# EAGLE design motor-control-board (EAGLE 7.2.0)
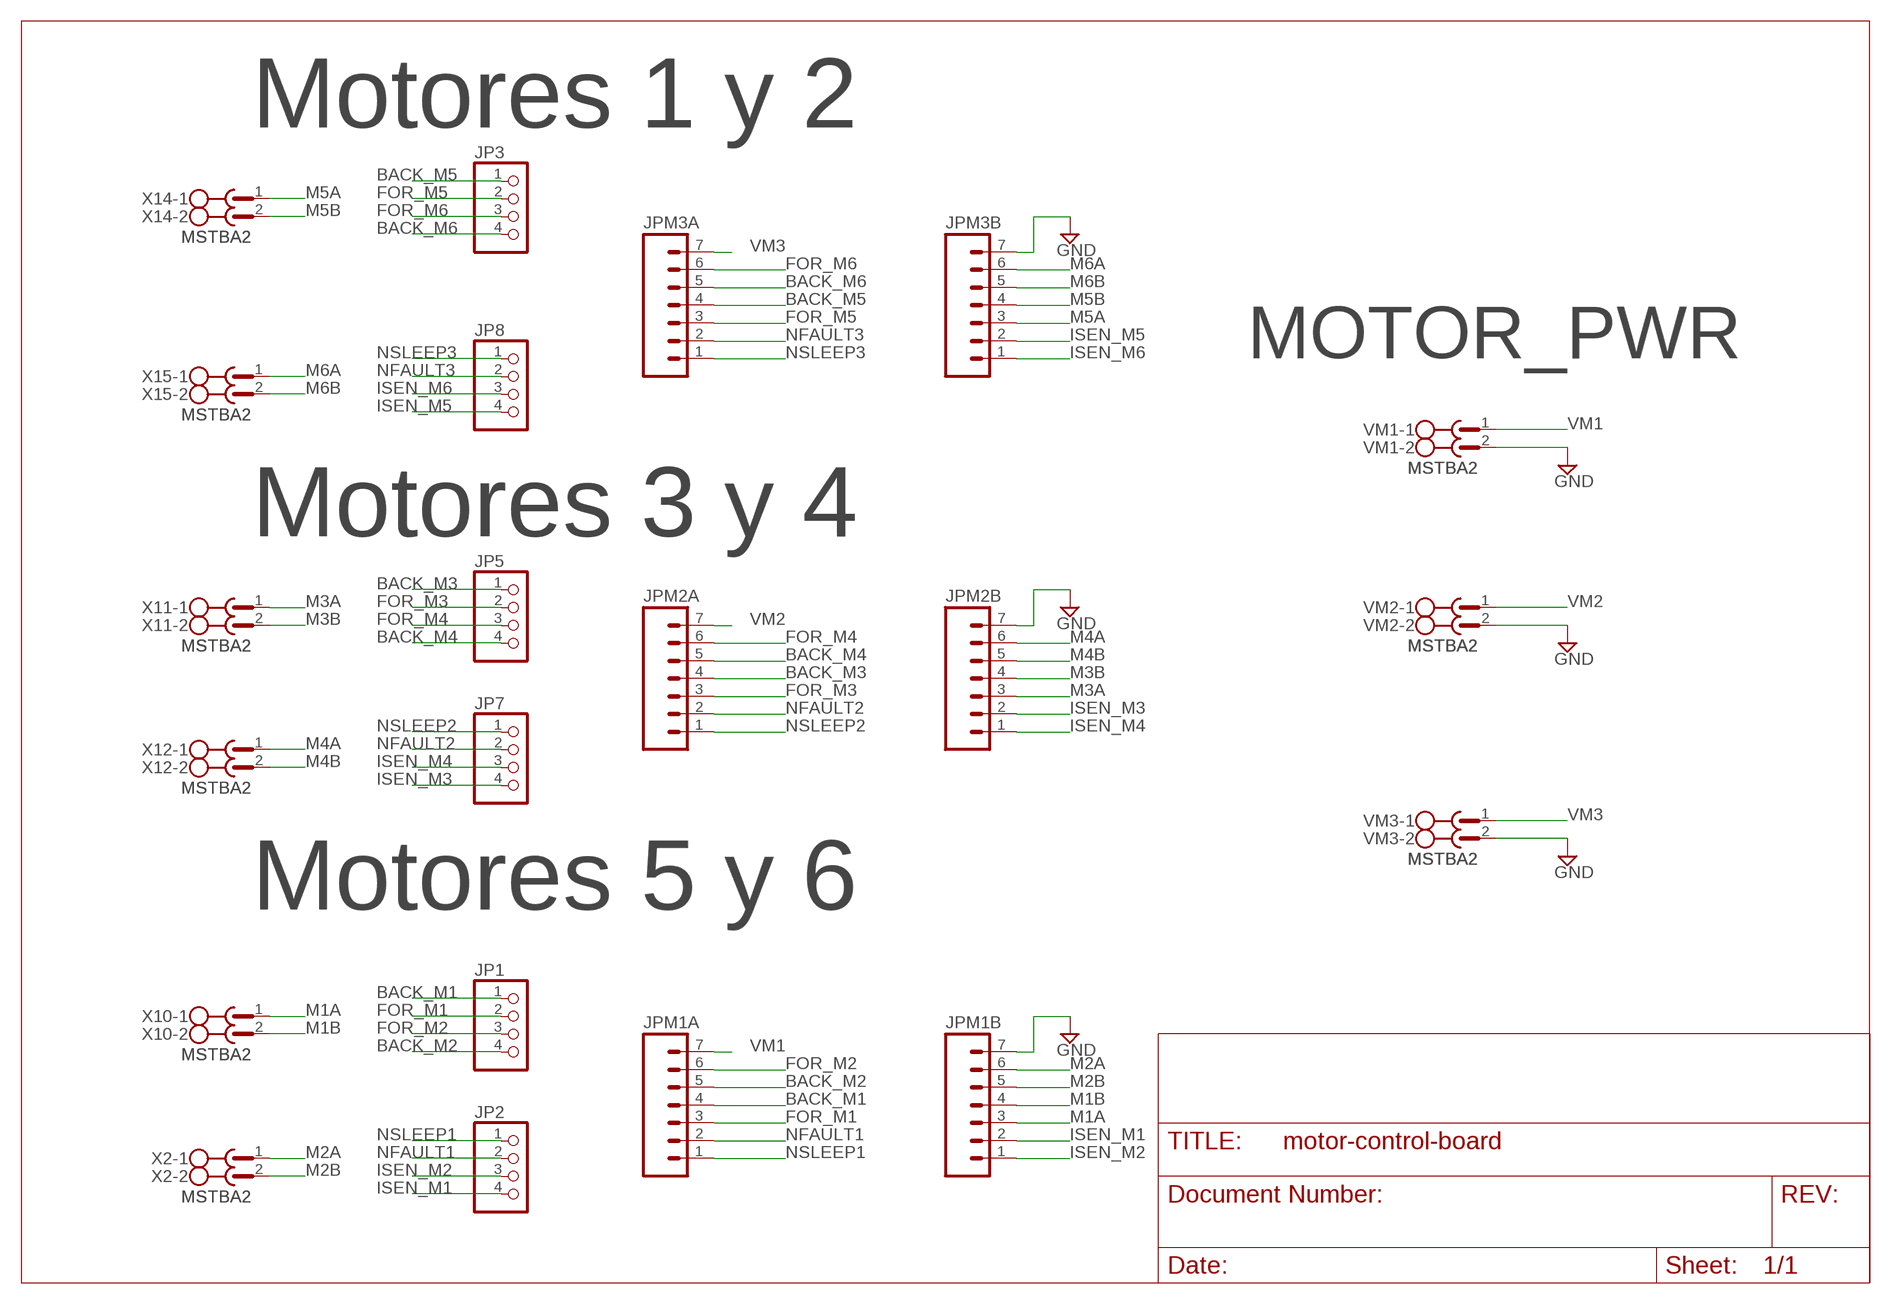
[diagram p0: schematic, sheet 1]

## Parts
JP1  PINHD-1X4  [1X04]
JP2  PINHD-1X4  [1X04]
JP3  PINHD-1X4  [1X04]
JP5  PINHD-1X4  [1X04]
JP7  PINHD-1X4  [1X04]
JP8  PINHD-1X4  [1X04]
JPM1A  M07  [1X07]
JPM1B  M07  [1X07]
JPM2A  M07  [1X07]
JPM2B  M07  [1X07]
JPM3A  M07  [1X07]
JPM3B  M07  [1X07]
VM1  MSTBA2  [MSTBA2]
VM2  MSTBA2  [MSTBA2]
VM3  MSTBA2  [MSTBA2]
X2  MSTBA2  [MSTBA2]
X10  MSTBA2  [MSTBA2]
X11  MSTBA2  [MSTBA2]
X12  MSTBA2  [MSTBA2]
X14  MSTBA2  [MSTBA2]
X15  MSTBA2  [MSTBA2]

## Nets
BACK_M1: JP1.1 JPM1A.4
BACK_M2: JP1.4 JPM1A.5
BACK_M3: JP5.1 JPM2A.4
BACK_M4: JP5.4 JPM2A.5
BACK_M5: JP3.1 JPM3A.4
BACK_M6: JP3.4 JPM3A.5
FOR_M1: JP1.2 JPM1A.3
FOR_M2: JP1.3 JPM1A.6
FOR_M3: JP5.2 JPM2A.3
FOR_M4: JP5.3 JPM2A.6
FOR_M5: JP3.2 JPM3A.3
FOR_M6: JP3.3 JPM3A.6
GND: JPM1B.7 JPM2B.7 JPM3B.7 VM1.2 VM2.2 VM3.2
ISEN_M1: JP2.4 JPM1B.2
ISEN_M2: JP2.3 JPM1B.1
ISEN_M3: JP7.4 JPM2B.2
ISEN_M4: JP7.3 JPM2B.1
ISEN_M5: JP8.4 JPM3B.2
ISEN_M6: JP8.3 JPM3B.1
M1A: JPM1B.3 X10.1
M1B: JPM1B.4 X10.2
M2A: JPM1B.6 X2.1
M2B: JPM1B.5 X2.2
M3A: JPM2B.3 X11.1
M3B: JPM2B.4 X11.2
M4A: JPM2B.6 X12.1
M4B: JPM2B.5 X12.2
M5A: JPM3B.3 X14.1
M5B: JPM3B.4 X14.2
M6A: JPM3B.6 X15.1
M6B: JPM3B.5 X15.2
NFAULT1: JP2.2 JPM1A.2
NFAULT2: JP7.2 JPM2A.2
NFAULT3: JP8.2 JPM3A.2
NSLEEP1: JP2.1 JPM1A.1
NSLEEP2: JP7.1 JPM2A.1
NSLEEP3: JP8.1 JPM3A.1
VM1: JPM1A.7 VM1.1
VM2: JPM2A.7 VM2.1
VM3: JPM3A.7 VM3.1

## Notes on the sheet
- Motores 1 y 2
- MOTOR_PWR
- Motores 3 y 4
- Motores 5 y 6

## Library data of the parts
JP1-JP3 JP5 JP7 JP8 = -redpic-connector(1):PINHD-1X4: Pin Header 4
JPM1A JPM1B JPM2A JPM2B JPM3A JPM3B = SparkFun-Connectors:M07: Header 7 Standard 7-pin 0.1" header. Use with straight break away headers (SKU : PRT-00116), right angle break away headers (PRT-00553), swiss pins (PRT-00743), machine pins (PRT-00117), and female headers (PRT-00115). NOTES ON THE VARIANTS LOCK and LOCK_LONGPADS... This footprint was designed to help hold the alignment of a through-hole component (i.e. 7-pin header) while soldering it into place. You may notice that each hole has been shifted either up or down by 0.005 of an inch from it's more standard position (which is usually a perfectly straight line). This slight alteration caused the pins (the squares in the middle) to touch the edges of the holes. Because they are alternating, it causes a "brace" to hold the header in place. 0.005 has proven to be the perfect amount of "off-center" position when using our standard breakaway headers. Although looks a little odd when you look at the bare footprint, once you have a header in there, the alteration is very hard to notice. Also, if you push a header all the way into place, it is covered up entirely on the bottom side. This idea of altering the position of holes to aid alignment will be further integrated into the Sparkfun Library for other footprints. It can help hold any component with 3 or more connection pins.
VM1-VM3 X2 X10-X12 X14 X15 = -redpic-connector(1):MSTBA2: Conector PHOENIX Clema 2 pines

## Board
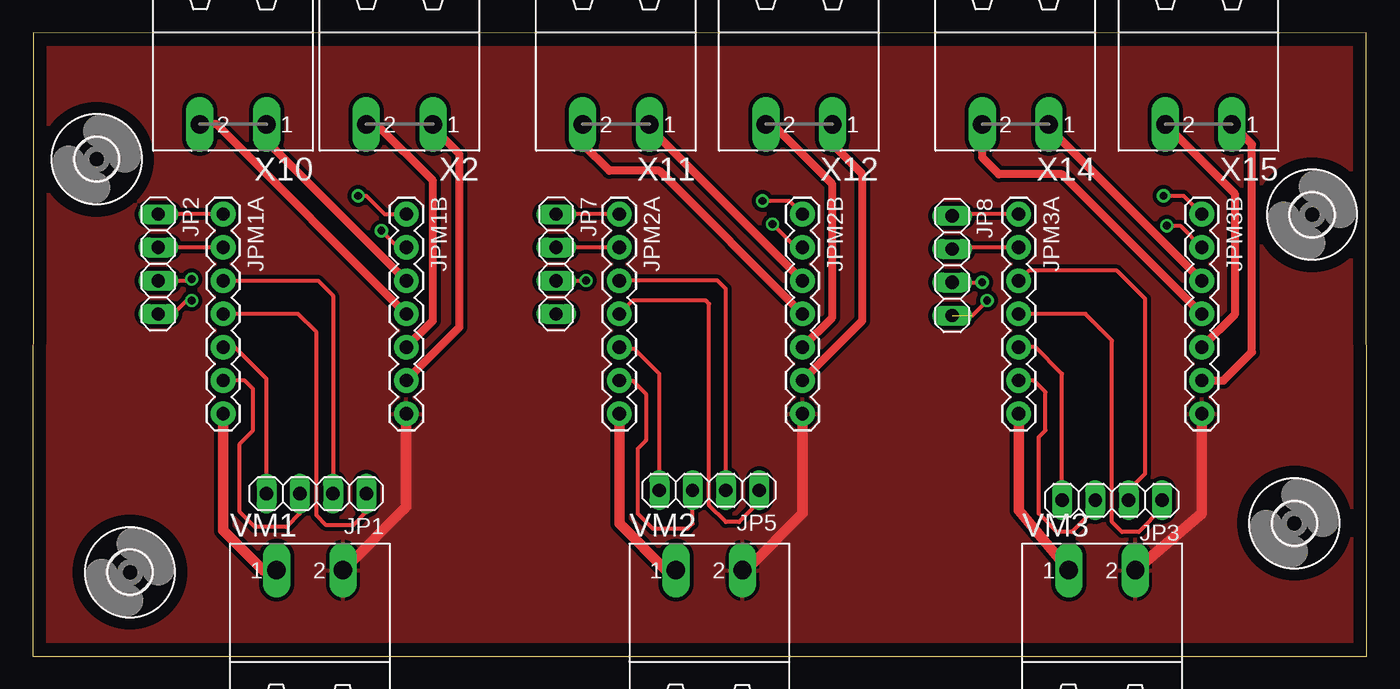
[diagram p1: board, top side]
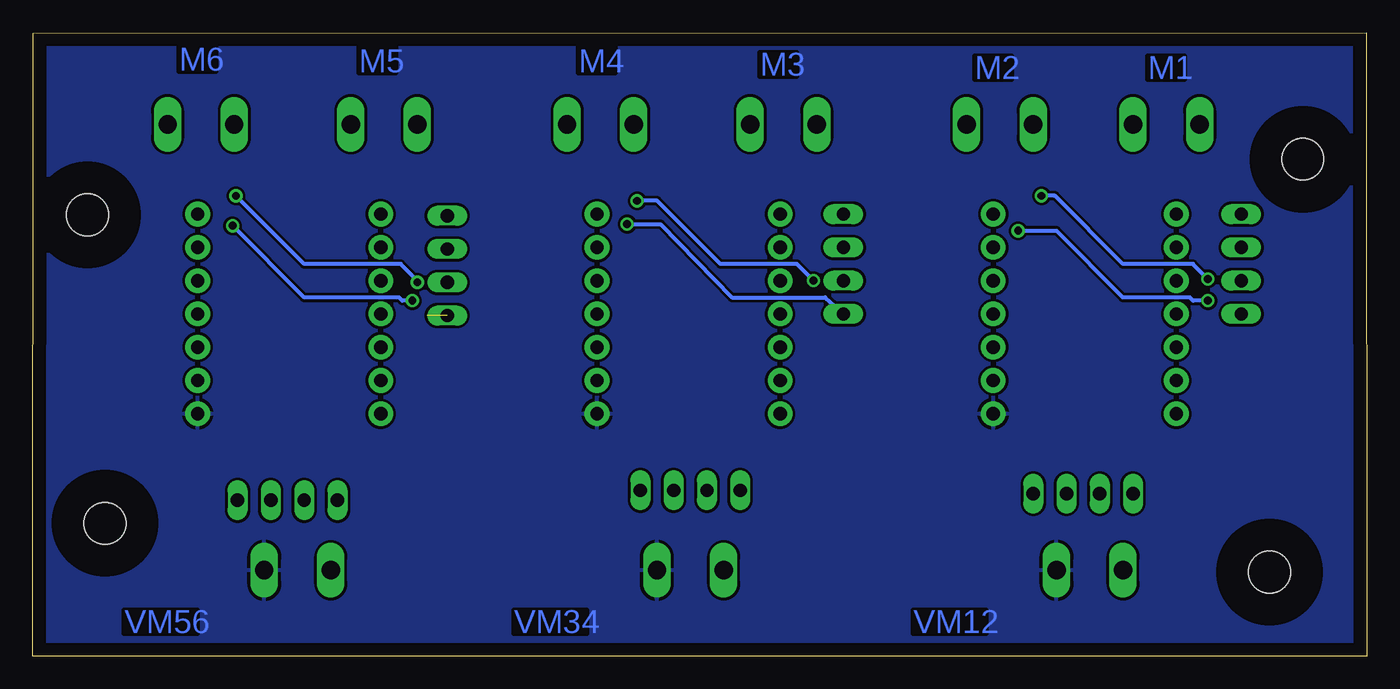
[diagram p2: board, bottom side, seen from below]

Size 101.78 x 47.57 mm. Coordinates in mm from the lower left corner, seen from the top.
Outline: 0,0 101.78,0 101.73,47.52 0.05,47.57 0,0
Copper layers (1*16): Top 0.035mm / dielectric 1.5mm / Bottom 0.035mm
Design rules "default": minimum track width 10mil, minimum drill 24mil, track to track 8mil, track to pad 8mil, pad to pad 8mil, via to via 8mil, smd to smd 8mil, copper to edge 40mil, drill to drill 8mil, minimum pad ring 10mil, minimum via ring 8mil, stop-mask expansion 4mil, vias tented up to drill 0mil, thermal gap 10mil

### Footprints (pad centres in the part's own frame; a part is rotated, then mirrored left to right if it is on the bottom)
1X04 = drill 1.016 long: 1 -3.81,0; 2 -1.27,0; 3 1.27,0; 4 3.81,0
1X07 = drill 1.016 pad 1.88: 1 0,0; 2 2.54,0; 3 5.08,0; 4 7.62,0; 5 10.16,0; 6 12.7,0; 7 15.24,0
3,2 = hole 3.2: 0,0
MSTBA2 = drill 1.397 pad 2.096 long: 1 -2.54,5.08; 2 2.54,5.08

### Placement (x,y rotation side)
JP1  21.64,12.4 180 top
JP2  9.58,29.92 270 top
JP3  82.35,11.89 180 top
JP5  51.61,12.65 180 top
JP7  39.93,29.92 270 top
JP8  70.15,29.79 270 top
JPM1A  14.53,33.73 270 top
JPM1B  28.5,33.73 270 top
JPM2A  44.75,33.73 270 top
JPM2B  58.72,33.73 270 top
JPM3A  75.23,33.73 270 top
JPM3B  89.2,33.73 270 top
U$10  [3,2]  4.88,37.92 0 top
U$11  [3,2]  97.61,33.68 0 top
U$12  [3,2]  96.27,10.13 0 top
U$13  [3,2]  7.42,6.4 0 top
VM1  21.13,1.47 0 top
VM2  51.61,1.47 0 top
VM3  81.58,1.47 0 top
X2  27.99,45.67 180 top
X10  15.29,45.67 180 top
X11  44.5,45.67 180 top
X12  58.47,45.67 180 top
X14  74.98,45.67 180 top
X15  88.95,45.67 180 top

### Tracks (layer width: path | path; a pad name or v marks a point on that pad's centre or on a via)
BACK_M1
  Top 0.305: JP1.1 25.45,11 24.43,9.98 22.4,9.98 21.64,10.74 21.64,24.71 20.24,26.11 JPM1A.4
BACK_M2
  Top 0.305: JP1.4 17.83,21.16 15.42,23.57 JPM1A.5
BACK_M3
  Top 0.305: JPM2A.4 45.77,27.13 51.36,27.13 51.61,26.87 51.61,11.51 52.88,10.24 53.9,10.24 55.42,11.76 JP5.1
BACK_M4
  Top 0.305: JP5.4 47.8,21.54 45.9,23.44 44.88,23.44 JPM2A.5
BACK_M5
  Top 0.305: JP3.1 86.16,11.25 84.38,9.47 83.11,9.47 82.35,10.24 82.35,24.08 80.31,26.11 JPM3A.4
BACK_M6
  Top 0.305: JP3.4 78.54,21.54 76.5,23.57 JPM3A.5
FOR_M1
  Top 0.305: JPM1A.3 21.77,28.65 22.91,27.51 JP1.2
FOR_M2
  Top 0.305: JP1.3 20.37,10.87 19.35,9.86 16.94,9.86 15.8,11 15.8,16.21 16.81,17.22 16.81,20.4 16.18,21.03 JPM1A.6
FOR_M3
  Top 0.305: JPM2A.3 52.25,28.65 52.88,28.02 JP5.2
FOR_M4
  Top 0.305: 50.54,12.84 JP5.3 50.34,10.11 49.96,9.73 47.29,9.73 46.15,10.87 46.15,15.82 46.79,16.46 46.79,20.02 45.77,21.03 JPM2A.6
FOR_M5
  Top 0.305: JPM3A.3 76,29.41 82.73,29.41 84.88,27.26 84.88,13.92 83.23,12.27 JP3.2
FOR_M6
  Top 0.305: JP3.3 81.08,11.25 79.3,9.47 78.16,9.47 76.76,10.87 76.76,16.71 77.27,17.22 77.27,20.14 76.38,21.03 JPM3A.6
GND
  Top 0.305: JPM2B.7 58.72,19.05 | JPM3B.7 88.49,18.49 | VM2.2 54.15,6.93
  Top 0.813: VM2.2 54.41,6.55 58.72,10.87 JPM2B.7 | VM3.2 89.2,10.87 JPM3B.7 | VM1.2 28.5,11.38 JPM1B.7
  pour Top (isolate 0.305): 0.3,47.19 0.3,0.36 101.45,0.36 101.45,47.19
  pour Bottom: -1.09,47.83 102.67,47.83 102.67,45.29 102.67,-2.21 -2.36,-2.21 -2.36,47.83
ISEN_M1  (via drill 0.6)
  Top 0.305: JPM1B.2 27.86,31.19 v26.59,32.46 | v12.12,27.13 11.73,27.13 10.59,25.98 9.7,25.98 JP2.4
  Bottom 0.305: v26.59,32.46 23.67,32.46 18.59,27.38 13.51,27.38 13.26,27.13 v12.12,27.13
ISEN_M2  (via drill 0.6)
  Top 0.305: JP2.3 11.99,28.65 v12.12,28.78 | v24.82,35.13 25.45,35.13 26.85,33.73 JPM1B.1
  Bottom 0.305: v24.82,35.13 23.8,35.13 18.59,29.92 13.26,29.92 v12.12,28.78
ISEN_M3  (via drill 0.6)
  Top 0.305: JPM2B.2 58.22,31.19 v56.44,32.97
  Bottom 0.305: v56.44,32.97 53.9,32.97 48.44,27.38 41.33,27.38 JP7.4
ISEN_M4  (via drill 0.6)
  Top 0.305: JP7.3 v42.21,28.65 | v55.68,34.75 57.71,34.75 JPM2B.1
  Bottom 0.305: v55.68,34.75 54.15,34.75 49.33,29.92 43.48,29.92 v42.21,28.65
ISEN_M5  (via drill 0.6)  (1 unrouted)
  Top 0.305: 71.68,25.98 v72.82,27.13 | v86.54,32.84 87.55,32.84 JPM3B.2
  Bottom 0.305: v72.82,27.13 73.58,27.13 73.84,27.38 81.08,27.38 v86.54,32.84
ISEN_M6  (via drill 0.6)
  Top 0.305: JP8.3 v72.44,28.52 | v86.28,35.13 87.81,35.13 JPM3B.1
  Bottom 0.305: v72.44,28.52 72.44,28.65 73.71,29.92 81.08,29.92 v86.28,35.13
M1A
  Top 0.61: JPM1B.3 17.83,39.32 X10.1
M1B
  Top 0.61: JPM1B.4 14.02,40.59 X10.2
M2A
  Top 0.61: JPM1B.6 32.56,25.1 32.56,38.3 30.53,40.34 X2.1
M2B
  Top 0.61: JPM1B.5 30.53,25.6 30.53,36.27 26.21,40.59 X2.2
M3A
  Top 0.61: JPM2B.3 47.04,40.34 X11.1
M3B
  Top 0.61: JPM2B.4 47.8,37.03 43.99,37.03 41.96,39.07 X11.2
M4A
  Top 0.61: JPM2B.6 63.3,25.6 63.3,36.78 61.01,39.07 X12.1
M4B
  Top 0.61: JPM2B.5 61.01,25.86 61.01,36.02 56.44,40.59 X12.2
M5A
  Top 0.61: JPM3B.3 77.52,40.34 X14.1
M5B
  Top 0.61: JPM3B.4 78.54,36.78 73.71,36.78 72.44,38.05 X14.2
M6A
  Top 0.61: JPM3B.6 90.86,21.03 93.01,23.19 93.01,39.07 X15.1
M6B
  Top 0.61: JPM3B.5 91.74,26.11 91.74,35.26 X15.2
NFAULT1
  Top 0.305: JPM1A.2 JP2.2
NFAULT2
  Top 0.305: JPM2A.2 JP7.2
NFAULT3
  Top 0.305: JPM3A.2 70.28,31.19 JP8.2
NSLEEP1
  Top 0.305: JPM1A.1 JP2.1
NSLEEP2
  Top 0.305: JPM2A.1 JP7.1 | JP7.1 39.55,33.73 39.42,33.6 39.8,33.6 JP7.1
NSLEEP3
  Top 0.305: JPM3A.1 70.28,33.73 JP8.1
VM1
  Top 0.813: VM1.1 17.58,6.55 14.53,9.6 JPM1A.7
VM2
  Top 0.813: VM2.1 48.31,6.55 44.75,10.11 JPM2A.7
VM3
  Top 0.813: VM3.1 75.23,11.13 JPM3A.7

### Text on the board
Bottom: M6 | M1 | M2 | M3 | M4 | M5 | VM12 | VM34 | VM56